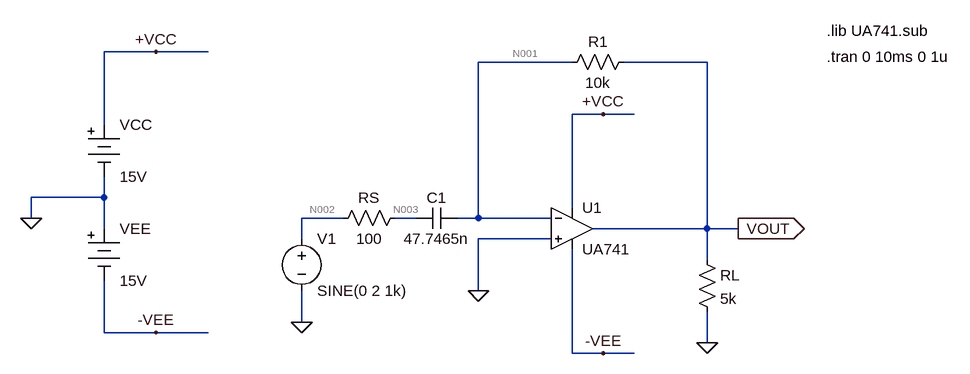
[diagram p0: schematic lab2-1.asc]
lab2-1.asc, the LTspice schematic file:
Version 4
SHEET 1 960 724
WIRE -304 -96 -384 -96
WIRE -224 -96 -304 -96
WIRE 336 -80 192 -80
WIRE 544 -80 416 -80
WIRE 384 0 336 0
WIRE 432 0 384 0
WIRE -384 16 -384 -96
WIRE -384 128 -384 96
WIRE -384 128 -496 128
WIRE 336 144 336 0
WIRE -496 160 -496 128
WIRE -16 160 -80 160
WIRE 96 160 64 160
WIRE 192 160 192 -80
WIRE 192 160 160 160
WIRE 304 160 192 160
WIRE -384 176 -384 128
WIRE 544 176 544 -80
WIRE 544 176 368 176
WIRE 592 176 544 176
WIRE -80 192 -80 160
WIRE 304 192 192 192
WIRE 544 224 544 176
WIRE 192 272 192 192
WIRE -80 320 -80 272
WIRE -384 336 -384 256
WIRE -304 336 -384 336
WIRE -224 336 -304 336
WIRE 544 352 544 304
WIRE 336 368 336 208
WIRE 384 368 336 368
WIRE 432 368 384 368
FLAG 592 176 VOUT
IOPIN 592 176 Out
FLAG -496 160 0
FLAG -304 -96 +VCC
FLAG 384 0 +VCC
FLAG -304 336 -VEE
FLAG 384 368 -VEE
FLAG 544 352 0
FLAG 192 272 0
FLAG -80 320 0
SYMBOL Opamps\\opamp2 336 112 R0
SYMATTR InstName U1
SYMATTR Value UA741
SYMBOL res 528 208 R0
SYMATTR InstName RL
SYMATTR Value 5k
SYMBOL Misc\\battery -384 0 R0
SYMATTR InstName VCC
SYMATTR Value 15V
SYMBOL Misc\\battery -384 160 R0
SYMATTR InstName VEE
SYMATTR Value 15V
SYMBOL cap 160 144 R90
WINDOW 0 0 32 VBottom 2
WINDOW 3 32 32 VTop 2
SYMATTR InstName C1
SYMATTR Value 47.7465n
SYMBOL res 432 -96 R90
WINDOW 0 0 56 VBottom 2
WINDOW 3 32 56 VTop 2
SYMATTR InstName R1
SYMATTR Value 10k
SYMBOL voltage -80 176 R0
WINDOW 123 0 0 Left 2
WINDOW 39 0 0 Left 2
SYMATTR InstName V1
SYMATTR Value SINE(0 2 1k)
SYMBOL res 80 144 R90
WINDOW 0 0 56 VBottom 2
WINDOW 3 32 56 VTop 2
SYMATTR InstName RS
SYMATTR Value 100
TEXT 728 -128 Left 2 !.lib UA741.sub
TEXT 728 -88 Left 2 !.tran 0 10ms 0 1u

The netlist it stands for:
* lab2-1.asc
XU1 0 N001 +VCC -VEE VOUT UA741  ; pins In+ In- V+ V- OUT
RL VOUT 0 5k
VCC +VCC 0 15V
VEE 0 -VEE 15V
C1 N001 N003 47.7465n
R1 VOUT N001 10k
V1 N002 0 SINE(0 2 1k)
RS N003 N002 100
.lib UA741.sub
.tran 0 10ms 0 1u
.backanno
.end

* Results of the author's LTspice run, read from the files saved beside the schematic
* Operating Point, zero values left out:
*   V(vout) = 808.8 µV
*   V(-vee) = -15 V
*   V(+vcc) = 15 V
*   V(n001) = 11.18 µV
*   I(R1) = 79.76 nA
*   I(Rl) = 161.8 nA
*   I(Vee) = -1.667 mA
*   I(Vcc) = -1.667 mA
*   Ix(u1:1) = 79.74 nA
*   Ix(u1:2) = 79.76 nA
*   Ix(u1:3) = 1.667 mA
*   Ix(u1:4) = -1.667 mA
*   Ix(u1:5) = -241.5 nA
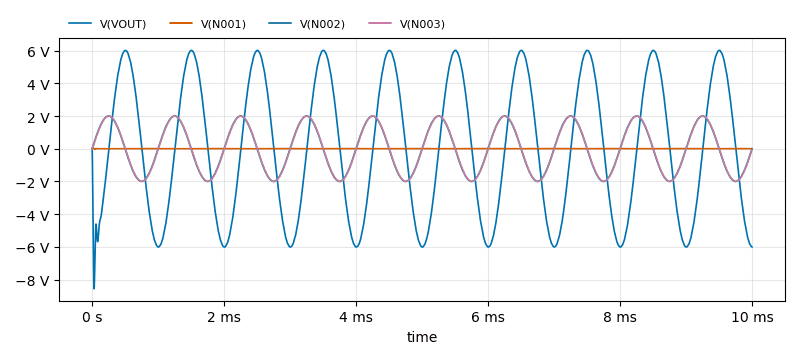
[diagram p1: Transient Analysis of lab2-1.asc, plotted from the saved traces]
* Transient Analysis, 1 run:
*   V(VOUT): min -8.569 V, max 6.015 V, average 3.273 mV, rms 4.254 V, last -6.011 V
*   V(N001): min -33.93 mV, max 79.81 mV, average 121 µV, rms 5.279 mV, last 216.9 µV
*   V(N002): min -2 V, max 2 V, average 168.8 µV, rms 1.414 V, last 0 V
*   V(N003): min -1.999 V, max 1.999 V, average 192.3 µV, rms 1.413 V, last -60.12 mV